# Altium schematic sheet main-3.SchDoc
size A4
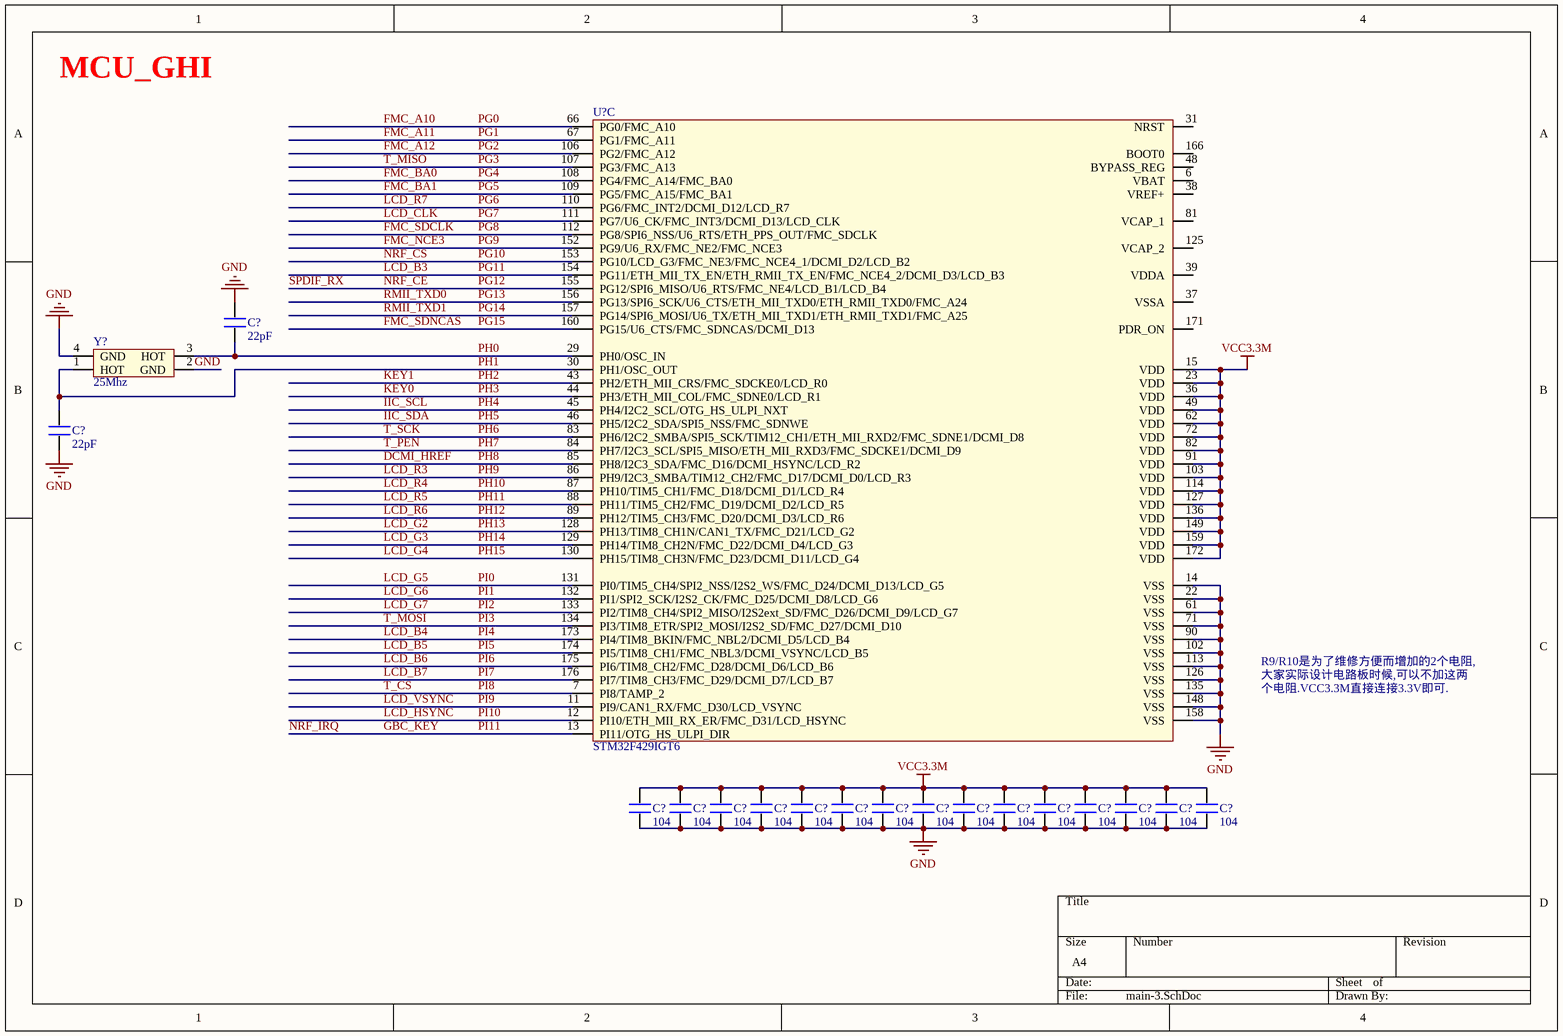
[diagram p0: main-3.SchDoc]

## Parts
(Parts that share a designator on the sheet are numbered #1, #2 ... from top to bottom, then left to right.)
C?#1  22pF  [0402]
C?#2  22pF  [0402]
C?#3  104  [0402]
C?#4  104  [0402]
C?#5  104  [0402]
C?#6  104  [0402]
C?#7  104  [0402]
C?#8  104  [0402]
C?#9  104  [0402]
C?#10  104  [0402]
C?#11  104  [0402]
C?#12  104  [0402]
C?#13  104  [0402]
C?#14  104  [0402]
C?#15  104  [0402]
C?#16  104  [0402]
C?#17  104  [0402]
U?  STM32F429IGT6  [LQFP176]  (part C of 3)
Y?  25Mhz  [XTAL3225]

## Nets
GND: C?#1.2 C?#2.1 C?#3.1 C?#4.1 C?#5.1 C?#6.1 C?#7.1 C?#8.1 C?#9.1 C?#10.1 C?#11.1 C?#12.1 C?#13.1 C?#14.1 C?#15.1 C?#16.1 C?#17.1 U?.14(VSS) U?.22(VSS) U?.61(VSS) U?.71(VSS) U?.90(VSS) U?.102(VSS) U?.113(VSS) U?.126(VSS) U?.135(VSS) U?.148(VSS) U?.158(VSS) Y?.2(GND) Y?.4(GND)
VCC3.3M: C?#3.2 C?#4.2 C?#5.2 C?#6.2 C?#7.2 C?#8.2 C?#9.2 C?#10.2 C?#11.2 C?#12.2 C?#13.2 C?#14.2 C?#15.2 C?#16.2 C?#17.2 U?.15(VDD) U?.23(VDD) U?.36(VDD) U?.49(VDD) U?.62(VDD) U?.72(VDD) U?.82(VDD) U?.91(VDD) U?.103(VDD) U?.114(VDD) U?.127(VDD) U?.136(VDD) U?.149(VDD) U?.159(VDD) U?.172(VDD)
DCMI_HREF: U?.85(PH8/I2C3_SDA/FMC_D16/DCMI_HSYNC/LCD_R2)  [also labelled PH8]
~{F}MC_SDCLK: U?.112(PG8/SPI6_NSS/U6_RTS/ETH_PPS_OUT/FMC_SDCLK)  [also labelled PG8]
FMC_A10: U?.66(PG0/FMC_A10)  [also labelled PG0]
FMC_A11: U?.67(PG1/FMC_A11)  [also labelled PG1]
FMC_A12: U?.106(PG2/FMC_A12)  [also labelled PG2]
FMC_BA0: U?.108(PG4/FMC_A14/FMC_BA0)  [also labelled PG4]
FMC_BA1: U?.109(PG5/FMC_A15/FMC_BA1)  [also labelled PG5]
FMC_NCE3: U?.152(PG9/U6_RX/FMC_NE2/FMC_NCE3)  [also labelled PG9]
FMC_SDNCAS: U?.160(PG15/U6_CTS/FMC_SDNCAS/DCMI_D13)  [also labelled PG15]
GBC_KEY: U?.13(PI11/OTG_HS_ULPI_DIR)  [also labelled NRF_IRQ, PI11]
IIC_SCL: U?.45(PH4/I2C2_SCL/OTG_HS_ULPI_NXT)  [also labelled PH4]
IIC_SDA: U?.46(PH5/I2C2_SDA/SPI5_NSS/FMC_SDNWE)  [also labelled PH5]
KEY0: U?.44(PH3/ETH_MII_COL/FMC_SDNE0/LCD_R1)  [also labelled PH3]
KEY1: U?.43(PH2/ETH_MII_CRS/FMC_SDCKE0/LCD_R0)  [also labelled PH2]
LCD_B3: U?.154(PG11/ETH_MII_TX_EN/ETH_RMII_TX_EN/FMC_NCE4_2/DCMI_D3/LCD_B3)  [also labelled PG11]
LCD_B4: U?.173(PI4/TIM8_BKIN/FMC_NBL2/DCMI_D5/LCD_B4)  [also labelled PI4]
LCD_B5: U?.174(PI5/TIM8_CH1/FMC_NBL3/DCMI_VSYNC/LCD_B5)  [also labelled PI5]
LCD_B6: U?.175(PI6/TIM8_CH2/FMC_D28/DCMI_D6/LCD_B6)  [also labelled PI6]
LCD_B7: U?.176(PI7/TIM8_CH3/FMC_D29/DCMI_D7/LCD_B7)  [also labelled PI7]
LCD_CLK: U?.111(PG7/U6_CK/FMC_INT3/DCMI_D13/LCD_CLK)  [also labelled PG~{7}]
LCD_G2: U?.128(PH13/TIM8_CH1N/CAN1_TX/FMC_D21/LCD_G2)  [also labelled PH13]
LCD_G3: U?.129(PH14/TIM8_CH2N/FMC_D22/DCMI_D4/LCD_G3)  [also labelled PH14]
LCD_G4: U?.130(PH15/TIM8_CH3N/FMC_D23/DCMI_D11/LCD_G4)  [also labelled PH15]
LCD_G5: U?.131(PI0/TIM5_CH4/SPI2_NSS/I2S2_WS/FMC_D24/DCMI_D13/LCD_G5)  [also labelled PI0]
LCD_G6: U?.132(PI1/SPI2_SCK/I2S2_CK/FMC_D25/DCMI_D8/LCD_G6)  [also labelled PI1]
LCD_G7: U?.133(PI2/TIM8_CH4/SPI2_MISO/I2S2ext_SD/FMC_D26/DCMI_D9/LCD_G7)  [also labelled PI2]
LCD_HSYNC: U?.12(PI10/ETH_MII_RX_ER/FMC_D31/LCD_HSYNC)  [also labelled PI10]
LCD_R3: U?.86(PH9/I2C3_SMBA/TIM12_CH2/FMC_D17/DCMI_D0/LCD_R3)  [also labelled PH9]
LCD_R4: U?.87(PH10/TIM5_CH1/FMC_D18/DCMI_D1/LCD_R4)  [also labelled PH10]
LCD_R5: U?.88(PH11/TIM5_CH2/FMC_D19/DCMI_D2/LCD_R5)  [also labelled PH11]
LCD_R6: U?.89(PH12/TIM5_CH3/FMC_D20/DCMI_D3/LCD_R6)  [also labelled PH12]
LCD_R7: U?.110(PG6/FMC_INT2/DCMI_D12/LCD_R7)  [also labelled PG6]
LCD_VSYNC: U?.11(PI9/CAN1_RX/FMC_D30/LCD_VSYNC)  [also labelled PI9]
NR~{F}_CS: U?.153(PG10/LCD_G3/FMC_NE3/FMC_NCE4_1/DCMI_D2/LCD_B2)  [also labelled PG10]
NRF_CE: U?.155(PG12/SPI6_MISO/U6_RTS/FMC_NE4/LCD_B1/LCD_B4)  [also labelled PG12, SPDIF_RX]
PG3: U?.107(PG3/FMC_A13)  [also labelled T_MISO]
PG13: U?.156(PG13/SPI6_SCK/U6_CTS/ETH_MII_TXD0/ETH_RMII_TXD0/FMC_A24)  [also labelled RMII_TXD0]
PG14: U?.157(PG14/SPI6_MOSI/U6_TX/ETH_MII_TXD1/ETH_RMII_TXD1/FMC_A25)  [also labelled RMII_TXD1]
PH0: C?#1.1 U?.29(PH0/OSC_IN) Y?.3(HOT)
PH1: C?#2.2 U?.30(PH1/OSC_OUT) Y?.1(HOT)
PH6: U?.83(PH6/I2C2_SMBA/SPI5_SCK/TIM12_CH1/ETH_MII_RXD2/FMC_SDNE1/DCMI_D8)  [also labelled T_SCK]
PH7: U?.84(PH7/I2C3_SCL/SPI5_MISO/ETH_MII_RXD3/FMC_SDCKE1/DCMI_D9)  [also labelled T_PEN]
PI3: U?.134(PI3/TIM8_ETR/SPI2_MOSI/I2S2_SD/FMC_D27/DCMI_D10)  [also labelled T_MOSI]
PI8: U?.7(PI8/TAMP_2)  [also labelled T_CS]

Not connected (* = marked no-connect by the designer): U? 6(VBAT) 31(NRST) 37(VSSA) 38(VREF+) 39(VDDA) 48(BYPASS_REG) 81(VCAP_1) 125(VCAP_2) 166(BOOT0) 171(PDR_ON)

## Notes on the sheet
- MCU_GHI
- R9/R10是为了维修方便而增加的2个电阻,大家实际设计电路板时候,可以不加这两个电阻.VCC3.3M直接连接3.3V即可.

## Library data of the parts
C?#1-C?#17 = CAP
U? = STM32F429IGT6: 意法半导体MCU M4内核
Y? = XTAL_3225: 3225贴片无源晶振